# Altium project Lights_Board.PrjPcb (part 1 of 2)
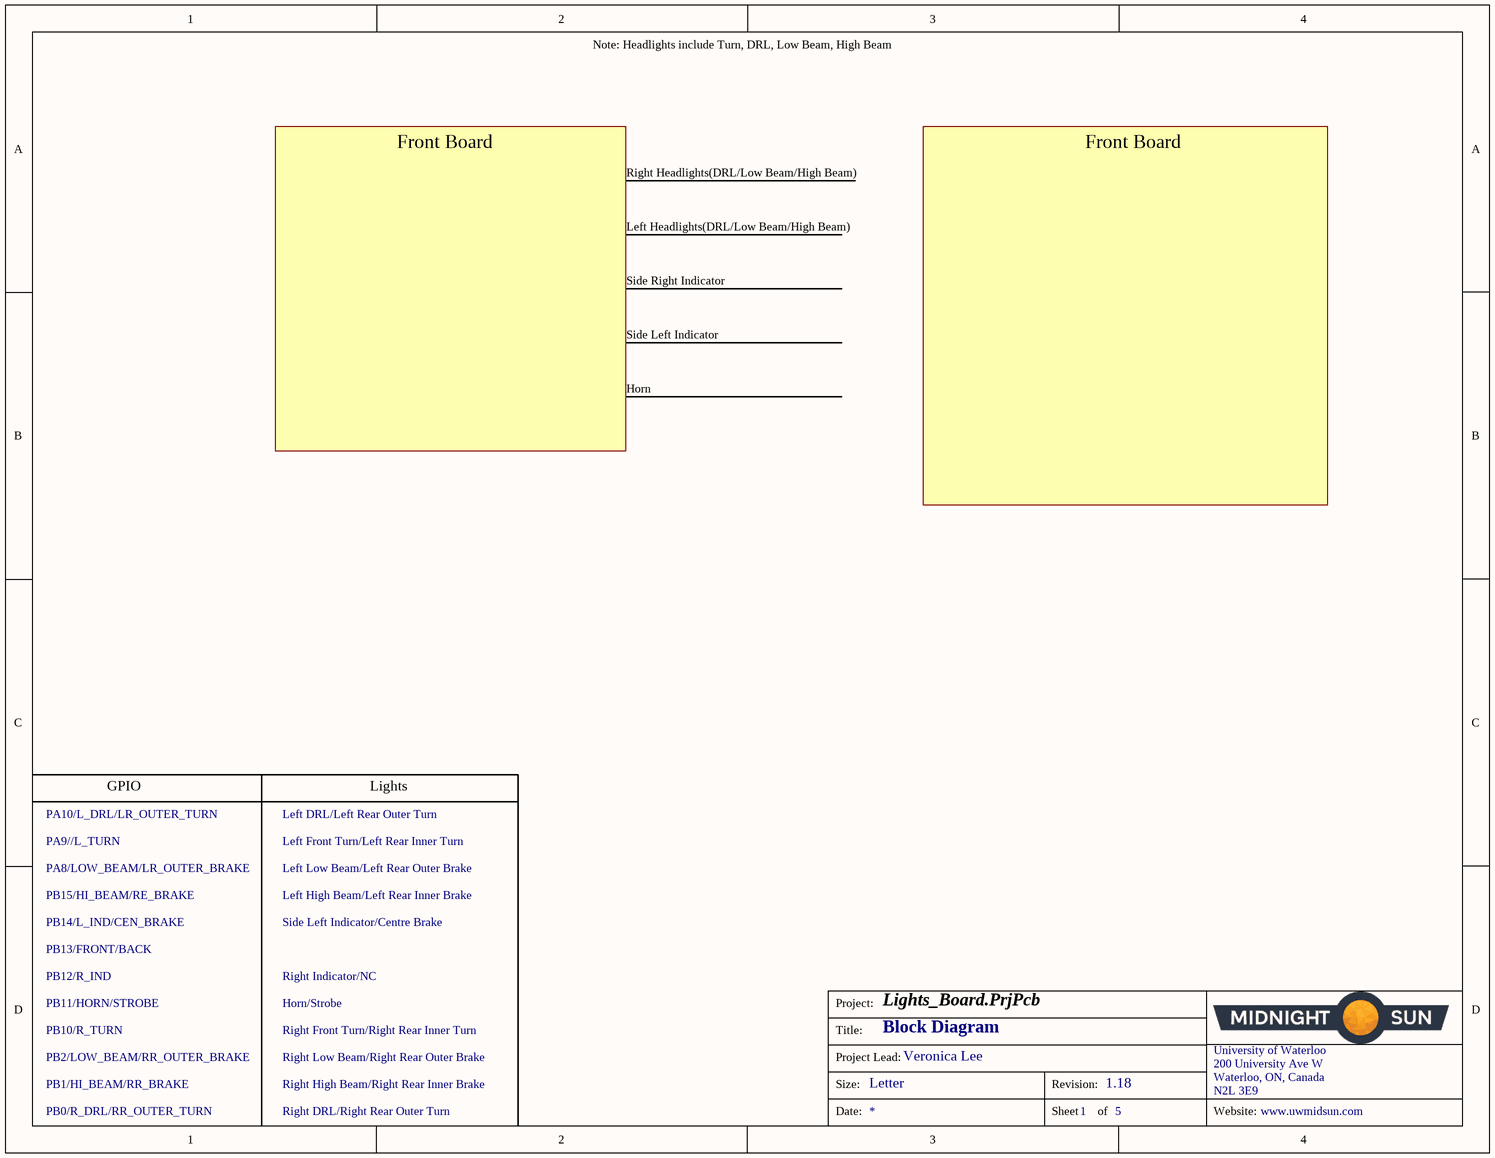
[diagram p0: Block_Diagram.SchDoc]
ProjectAuthor: Veronica Lee; ProjectRevision: 1.18
5 sheets, 80 parts. Net scope: flat (ports and power ports of the same name join across sheets).
Board file: MSXII_Lights.PcbDoc
Sheets:
  Block_Diagram.SchDoc
  Controller_Board_Interface.SchDoc
  Lights_Board.SchDoc
  Headlight_Left_Board.SchDoc
  Headlight_Right_Board.SchDoc

## Sheet Block_Diagram.SchDoc: Block Diagram
size Letter; Organization: Midnight Sun Solar Rayce Car Team; Address1: University of Waterloo; Address2: 200 University Ave W; Address3: Waterloo, ON, Canada; Address4: N2L 3E9; DocumentNumber: 1; SheetNumber: 1; SheetTotal: 5; Website: www.uwmidsun.com

### Notes on the sheet
- Note: Headlights include Turn, DRL, Low Beam, High Beam
- Front Board
- Right Headlights(DRL/Low Beam/High Beam)
- Left Headlights(DRL/Low Beam/High Beam)
- Side Right Indicator
- Side Left Indicator
- Horn
- PA10/L_DRL/LR_OUTER_TURN
- GPIO
- Left DRL/Left Rear Outer Turn
- Lights
- PA9//L_TURN
- PA8/LOW_BEAM/LR_OUTER_BRAKE
- PB15/HI_BEAM/RE_BRAKE
- Left Front Turn/Left Rear Inner Turn
- Left Low Beam/Left Rear Outer Brake
- Left High Beam/Left Rear Inner Brake
- PB14/L_IND/CEN_BRAKE
- PB13/FRONT/BACK
- Side Left Indicator/Centre Brake
- PB12/R_IND
- PB11/HORN/STROBE
- PB10/R_TURN
- Right Indicator/NC
- Horn/Strobe
- Right Front Turn/Right Rear Inner Turn
- PB2/LOW_BEAM/RR_OUTER_BRAKE
- PB1/HI_BEAM/RR_BRAKE
- Right Low Beam/Right Rear Outer Brake
- Right High Beam/Right Rear Inner Brake
- PB0/R_DRL/RR_OUTER_TURN
- Right DRL/Right Rear Outer Turn
- Project:
- Title:
- Size:
- Project Lead:
- Letter
- Revision:
- University of Waterloo
- 200 University Ave W
- Waterloo, ON, Canada
- N2L 3E9
- Date:
- Sheet
- of
- Website:

## Sheet Controller_Board_Interface.SchDoc
size Letter; DocumentNumber: 2; SheetNumber: 2; SheetTotal: 5; Website: www.uwmidsun.com
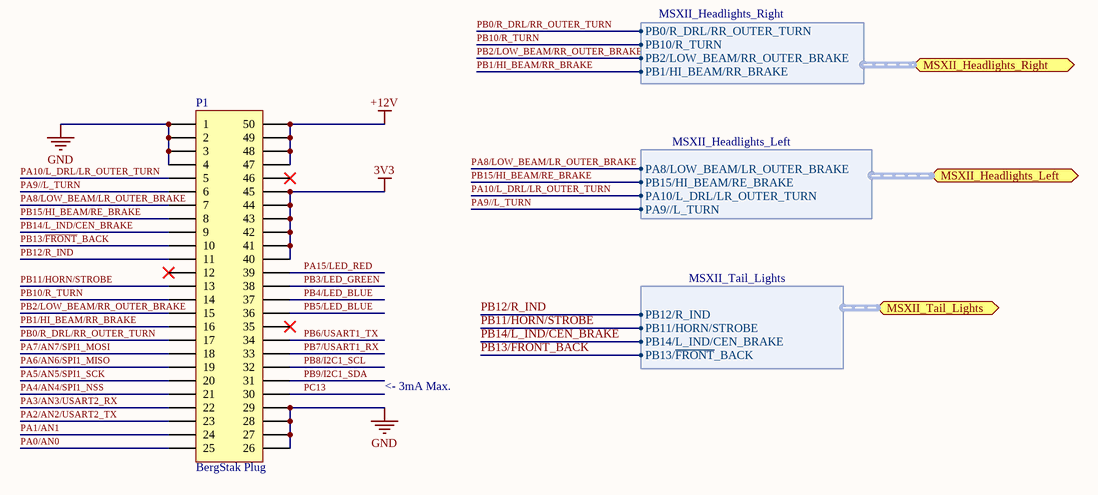
[diagram p1: Controller_Board_Interface.SchDoc]

### Parts
P1  Series: BergStak Plug  [CONN, Bergstak 50 Pos Plug]  (hidden comment: CONN 50POS Bergstak Plug 0.02")

### Ports
MSXII_Headlights_Left (harness MSXII_Headlights_Left), MSXII_Headlights_Right (harness MSXII_Headlights_Right), MSXII_Tail_Lights (harness MSXII_Tail_Lights)

### Harnesses
MSXII_Headlights_Right: PB0/R_DRL/RR_OUTER_TURN, PB10/R_TURN, PB2/LOW_BEAM/RR_OUTER_BRAKE, PB1/HI_BEAM/RR_BRAKE
MSXII_Headlights_Left: PA8/LOW_BEAM/LR_OUTER_BRAKE, PB15/HI_BEAM/RE_BRAKE, PA10/L_DRL/LR_OUTER_TURN, PA9//L_TURN
MSXII_Tail_Lights: PB14/L_IND/CEN_BRAKE, PB11/HORN/STROBE, PB12/R_IND, PB13/~{FRONT}_BACK

### Nets
3V3: P1.40 P1.41 P1.42 P1.43 P1.44 P1.45
+12V: P1.47 P1.48 P1.49 P1.50
GND: P1.1 P1.2 P1.3 P1.4 P1.26 P1.27 P1.28 P1.29
PA0/AN0: P1.25  [project net PA0/AN0_2]
PA1/AN1: P1.24  [project net PA1/AN1_2]
PA2/AN2/USART2_TX: P1.23  [project net PA2/AN2/USART2_TX_2]
PA3/AN3/USART2_RX: P1.22  [project net PA3/AN3/USART2_RX_2]
PA4/AN4/SPI1_NSS: P1.21  [project net PA4/AN4/SPI1_NSS_2]
PA5/AN5/SPI1_SCK: P1.20  [project net PA5/AN5/SPI1_SCK_2]
PA6/AN6/SPI1_MISO: P1.19  [project net PA6/AN6/SPI1_MISO_2]
PA7/AN7/SPI1_MOSI: P1.18  [project net PA7/AN7/SPI1_MOSI_2]
PA8/LOW_BEAM/LR_OUTER_BRAKE: P1.7 ; port MSXII_Headlights_Left.PA8/LOW_BEAM/LR_OUTER_BRAKE
PA9//L_TURN: P1.6 ; port MSXII_Headlights_Left.PA9//L_TURN
PA10/L_DRL/LR_OUTER_TURN: P1.5 ; port MSXII_Headlights_Left.PA10/L_DRL/LR_OUTER_TURN
PA15/LED_RED: P1.39  [project net PA15/LED_RED_2]
PB0/R_DRL/RR_OUTER_TURN: P1.17 ; port MSXII_Headlights_Right.PB0/R_DRL/RR_OUTER_TURN
PB1/HI_BEAM/RR_BRAKE: P1.16 ; port MSXII_Headlights_Right.PB1/HI_BEAM/RR_BRAKE
PB2/LOW_BEAM/RR_OUTER_BRAKE: P1.15 ; port MSXII_Headlights_Right.PB2/LOW_BEAM/RR_OUTER_BRAKE
PB3/LED_GREEN: P1.38  [project net PB3/LED_GREEN_2]
PB4/LED_BLUE: P1.37  [project net PB4/LED_BLUE_2]
PB5/LED_BLUE: P1.36  [project net PB5/LED_BLUE_2]
PB6/USART1_TX: P1.34  [project net PB6/USART1_TX_2]
PB7/USART1_RX: P1.33  [project net PB7/USART1_RX_2]
PB8/I2C1_SCL: P1.32  [project net PB8/I2C1_SCL_2]
PB9/I2C1_SDA: P1.31  [project net PB9/I2C1_SDA_2]
PB10/R_TURN: P1.14 ; port MSXII_Headlights_Right.PB10/R_TURN
PB11/HORN/STROBE: P1.13 ; port MSXII_Tail_Lights.PB11/HORN/STROBE
PB12/R_IND: P1.11 ; port MSXII_Tail_Lights.PB12/R_IND
PB13/~{FRONT}_BACK: P1.10 ; port MSXII_Tail_Lights.PB13/~{FRONT}_BACK
PB14/L_IND/CEN_BRAKE: P1.9 ; port MSXII_Tail_Lights.PB14/L_IND/CEN_BRAKE
PB15/HI_BEAM/RE_BRAKE: P1.8 ; port MSXII_Headlights_Left.PB15/HI_BEAM/RE_BRAKE
PC13: P1.30  [project net PC13_2]

Not connected (* = marked no-connect by the designer): P1 12* 35* 46*

### Notes on the sheet
- <- 3mA Max.
- Project:
- Title:
- Size:
- Project Lead:
- Letter
- Revision:
- University of Waterloo
- 200 University Ave W
- Waterloo, ON, Canada
- N2L 3E9
- Date:
- Sheet
- of
- Website:

### Library data of the parts
P1 = CONN 50POS Bergstak Plug 0.02": 50 Position Connector Plug, Outer Shroud Contacts Surface Mount Gold; Manufacturer 1: Amphenol FCI; Manufacturer Part Number 1: 10132797-055100LF; Number of Positions: 50; Mated Stacking Heights: 5mm; Pitch: 0.020" (0.50mm); Supplier 1: Digi-Key; Supplier Part Number 1: 609-5226-1-ND; Packaging: Cut Tape (CT); Part Status: Active; Connector Type: Plug, Outer Shroud Contacts; Number of Rows: 2; Mounting Type: Surface Mount; Contact Finish: Gold; Contact Finish Thickness: 1µin (0.025µm); Height Above Board: 0.169" (4.30mm); ComponentLink1URL: http://portal.fciconnect.com/Comergent//fci/drawing/10132797.pdf; ComponentLink1Description: http://portal.fciconnect.com/Comergent//fci/drawing/10132797.pdf

## Sheet Lights_Board.SchDoc: All Other Lights
size Letter; DocumentNumber: 3; Revision: 1.1; SheetNumber: 3; SheetTotal: 5; Website: www.uwmidsun.com
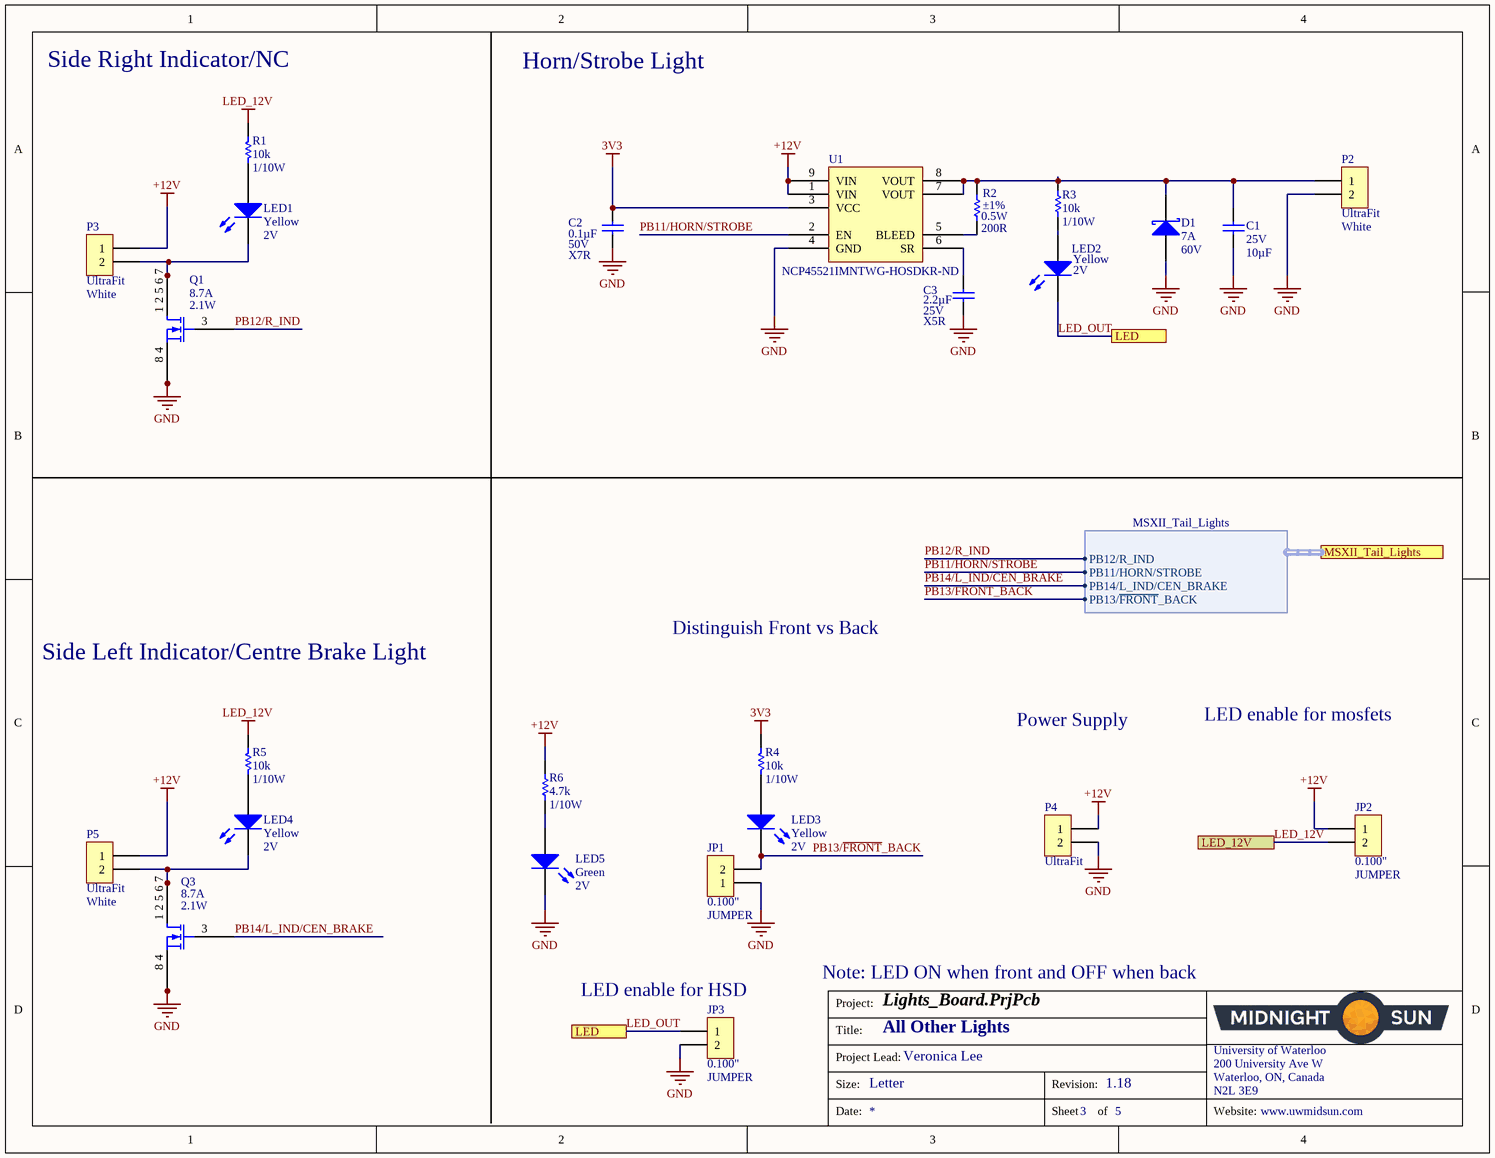
[diagram p2: Lights_Board.SchDoc]

### Parts
C1  Voltage - Rated: 25V  Capacitance: 10µF  [CAP, 0805]  (hidden comment: CAP CER 10uF 25V 10% X5R 0805)
C2  Capacitance: 0.1µF  Voltage: 50V  Temperature Coefficient: X7R  [CAP, 0603]  (hidden comment: CAP CER 0.1UF 50V 10% X7R 0603)
C3  Capacitance: 2.2µF  Voltage: 25V  Temperature Coefficient: X5R  [CAP, 0603]  (hidden comment: CAP CER 2.2UF 25V 10% X5R 0603)  (no BOM)
D1  Current - Average Rectified (Io): 7A  Voltage: 60V  [DIODE SCHOTTKY 60V 7A POWERDI5]  (hidden comment: DIODE SCHOTTKY 60V 7A POWERDI5)
JP1  Row Spacing - Mating: 0.100"  [CONN 2POS JUMPER 0.1"]  (hidden comment: JUMPER)
JP2  Row Spacing - Mating: 0.100"  [CONN 2POS JUMPER 0.1"]  (hidden comment: JUMPER)
JP3  Row Spacing - Mating: 0.100"  [CONN 2POS JUMPER 0.1"]  (hidden comment: JUMPER)
LED1  Color: Yellow  Voltage - Forward (Vf) (Typ): 2V  [LED_0603]  (hidden comment: LED YELLOW CLEAR 2.1V 0603)
LED2  Color: Yellow  Voltage - Forward (Vf) (Typ): 2V  [LED_0603]  (hidden comment: LED YELLOW CLEAR 2.1V 0603)
LED3  Color: Yellow  Voltage - Forward (Vf) (Typ): 2V  [LED_0603]  (hidden comment: LED YELLOW CLEAR 2.1V 0603)
LED4  Color: Yellow  Voltage - Forward (Vf) (Typ): 2V  [LED_0603]  (hidden comment: LED YELLOW CLEAR 2.1V 0603)
LED5  Color: Green  Voltage - Forward (Vf) (Typ): 2V  [LED_0603]  (hidden comment: LED GREEN CLEAR 2V 0603)
P2  Series: UltraFit  Color: White  [CONN, 2POS ULTRA-FIT - NATURAL COLOR]  (hidden comment: CONN 2POS ULTRA-FIT NATURAL COLOR 0.138")
P3  Series: UltraFit  Color: White  [CONN, 2POS ULTRA-FIT - NATURAL COLOR]  (hidden comment: CONN 2POS ULTRA-FIT NATURAL COLOR 0.138")
P4  Series: UltraFit  [CONN, 2POS ULTRA-FIT]  (hidden comment: CONN 2POS ULTRA-FIT 0.138")
P5  Series: UltraFit  Color: White  [CONN, 2POS ULTRA-FIT - NATURAL COLOR]  (hidden comment: CONN 2POS ULTRA-FIT NATURAL COLOR 0.138")
Q1  Current - Continuous Drain (Id) @ 25°C: 8.7A  Power Dissipation (Max): 2.1W  [MOSFET N-CH 30V 12A 2mmx2mm PQFN]  (hidden comment: MOSFET N-CH 30V 8.7A 2.1W 6-PQFN (2x2))
Q3  Current - Continuous Drain (Id) @ 25°C: 8.7A  Power Dissipation (Max): 2.1W  [MOSFET N-CH 30V 12A 2mmx2mm PQFN]  (hidden comment: MOSFET N-CH 30V 8.7A 2.1W 6-PQFN (2x2))
R1  Resistance: 10k  Power: 1/10W  [RES, 0603]  (hidden comment: RES 10K OHM 1% 1/10W 0603)
R2  resistance: 200R  Tolerance: ±1%  Power (Watts): 0.5W  [RES 0805]  (hidden comment: RES 200 OHM 5% 1/2W 0805)
R3  Resistance: 10k  Power: 1/10W  [RES, 0603]  (hidden comment: RES 10K OHM 1% 1/10W 0603)
R4  Resistance: 10k  Power: 1/10W  [RES, 0603]  (hidden comment: RES 10K OHM 1% 1/10W 0603)
R5  Resistance: 10k  Power: 1/10W  [RES, 0603]  (hidden comment: RES 10K OHM 1% 1/10W 0603)
R6  Resistance (Ohms): 4.7k  Power (Watts): 1/10W  [RES, 0603]  (hidden comment: RES 4.7K OHM 1% 1/10W 0603)
U1  Supplier Part Number 2: NCP45521IMNTWG-HOSDKR-ND  [IC LOAD SWITCH ACT-HI 10.5A 8DFN]  (hidden comment: IC LOAD SWITCH ACT-HI 10.5A 8DFN)

### Ports
LED, LED_12V (harness MSXII_Tail_Lights), MSXII_Tail_Lights (harness MSXII_Tail_Lights)

### Harnesses
MSXII_Tail_Lights: PB14/L_IND/CEN_BRAKE, PB11/HORN/STROBE, PB12/R_IND, PB13/~{FRONT}_BACK

### Nets
3V3: C2.1 R4.1 U1.3(VCC)
+12V: JP2.1 P3.1 P4.1 P5.1 R6.1 U1.1(VIN) U1.9(VIN)
GND: C1.2 C2.2 C3.2 D1.1 JP1.1 JP3.2 LED5.2(K) P2.2 P4.2 Q1.4(S) Q1.8(S) Q3.4(S) Q3.8(S) U1.4(GND)
LED_12V: JP2.2 R1.1 R5.1
LED_OUT: JP3.1 LED2.2(K) ; port LED
PB11/HORN/STROBE: U1.2(EN) ; port MSXII_Tail_Lights.PB11/HORN/STROBE
PB12/R_IND: Q1.3(G) ; port MSXII_Tail_Lights.PB12/R_IND
PB13/~{FRONT}_BACK: JP1.2 LED3.2(K) ; port MSXII_Tail_Lights.PB13/~{FRONT}_BACK
PB14/L_IND/CEN_BRAKE: Q3.3(G) ; port MSXII_Tail_Lights.PB14/L_IND/CEN_BRAKE
NetC1_1: C1.1 D1.2 P2.1 R2.1 R3.1 U1.7(VOUT) U1.8(VOUT)
NetC3_1: C3.1 U1.6(SR)
NetLED1_1: LED1.1(A) R1.2
NetLED1_2: LED1.2(K) P3.2 Q1.1(D) Q1.2(D) Q1.5(D) Q1.6(D) Q1.7(D)
NetLED2_1: LED2.1(A) R3.2
NetLED3_1: LED3.1(A) R4.2
NetLED4_1: LED4.1(A) R5.2
NetLED4_2: LED4.2(K) P5.2 Q3.1(D) Q3.2(D) Q3.5(D) Q3.6(D) Q3.7(D)
NetLED5_1: LED5.1(A) R6.2
NetR2_2: R2.2 U1.5(BLEED)

### Notes on the sheet
- Side Right Indicator/NC
- Horn/Strobe Light
- Distinguish Front vs Back
- Side Left Indicator/Centre Brake Light
- Power Supply
- LED enable for mosfets
- (near JP3) LED enable for HSD
- Note: LED ON when front and OFF when back
- Project:
- Title:
- Size:
- Project Lead:
- Letter
- Revision:
- University of Waterloo
- 200 University Ave W
- Waterloo, ON, Canada
- N2L 3E9
- Date:
- Sheet
- of
- Website:

### Library data of the parts
C1 = CAP CER 10uF 25V 10% X5R 0805: 10µF ±10% 25V Ceramic Capacitor X5R 0805 (2012 Metric); Manufacturer: Murata Electronics North America; Manufacturer Part Number: GRM21BR61E106KA73L; Supplier 1: Digi-Key; RoHS: RoHS Compliant; Category: Capacitors; Stock 1: 1695157; Packaging: Cut Tape (CT); Part Status: Active; Tolerance: ±10%; Temperature Coefficient: X5R; Operating Temperature: -55°C ~ 85°C; Features: -; Ratings: -; Applications: General Purpose; Mounting Type: Surface Mount, MLCC; Package / Case: 0805 (2012 Metric); Size / Dimension: 0.079" L x 0.049" W (2.00mm x 1.25mm); Height - Seated (Max): -; Thickness (Max): 0.053" (1.35mm); Lead Spacing: -; Lead Style: -; ComponentLink1URL: http://search.murata.co.jp/Ceramy/image/img/A01X/G101/ENG/GRM21BR61E106KA73-01.pdf; ComponentLink1Description: http://search.murata.co.jp/Ceramy/image/img/A01X/G101/ENG/GRM21BR61E106KA73-01.pdf; Supplier Part Number 1: 490-5523-1-ND; Pricing 1: 1=0.3, 10=0.214, 100=0.1008, 500=0.07068, 1000=0.05851 (CAD)
C2 = CAP CER 0.1UF 50V 10% X7R 0603: 0.10µF ±10% 50V Ceramic Capacitor X7R 0603 (1608 Metric); Manufacturer 1: AVX Corporation; Manufacturer Part Number 1: 06035C104KAT2A; Supplier 1: Digi-Key; Supplier Part Number 1: 478-5052-1-ND; Packaging: Cut Tape (CT); Part Status: Active; Operating Temperature: -55°C ~ 125°C; Ratings: -; Mounting Type: Surface Mount, MLCC; Package / Case: 0603 (1608 Metric); Size / Dimension: 0.063" L x 0.032" W (1.60mm x 0.81mm); Height - Seated (Max): -; Thickness (Max): 0.035" (0.90mm); Lead Spacing: -; Lead Style: -; ComponentLink1URL: http://datasheets.avx.com/X7RDielectric.pdf; ComponentLink1Description: http://datasheets.avx.com/X7RDielectric.pdf; Tolerance: ±10%
C3 = CAP CER 2.2UF 25V 10% X5R 0603: 2.2µF ±10% 25V Ceramic Capacitor X5R 0603 (1608 Metric); Manufacturer 1: Murata Electronics North America; Manufacturer Part Number 1: GRM188R61E225KA12D; Supplier 1: Digi-Key; Supplier Part Number 1: 490-10731-1-ND; Packaging: Cut Tape (CT); Part Status: Active; Operating Temperature: -55°C ~ 85°C; Ratings: -; Mounting Type: Surface Mount, MLCC; Package / Case: 0603 (1608 Metric); Size / Dimension: 0.063" L x 0.031" W (1.60mm x 0.80mm); Height - Seated (Max): -; Thickness (Max): 0.035" (0.90mm); Lead Spacing: -; Lead Style: -; ComponentLink1URL: http://www.murata.com/~/media/webrenewal/support/library/catalog/products/capacitor/mlcc/c02e.ashx; ComponentLink1Description: http://www.murata.com/~/media/webrenewal/support/library/catalog/products/capacitor/mlcc/c02e.ashx; Tolerance: ±10%
D1 = DIODE SCHOTTKY 60V 7A POWERDI5: Diode Schottky 60V 7A Surface Mount PowerDI™ 5; Manufacturer: Diodes Incorporated; Manufacturer Part Number: PDS760Q-13; Speed: Fast Recovery =< 500ns, > 200mA (Io); Supplier 1: Digi-Key; RoHS: RoHS Compliant; Category: Discrete Semiconductor Products; Stock 1: 35000; Pricing 1: 5000=0.48794, 10000=0.4696 (CAD); Packaging: Tape & Reel (TR); Part Status: Active; Diode Type: Schottky; Capacitance @ Vr, F: -; Mounting Type: Surface Mount; Package / Case: PowerDI™ 5; Supplier Device Package: PowerDI™ 5; Operating Temperature - Junction: -65°C ~ 150°C; ComponentLink1URL: https://www.diodes.com/assets/Datasheets/PDS760Q.pdf; ComponentLink1Description: https://www.diodes.com/assets/Datasheets/PDS760Q.pdf; Supplier 2: Digi-Key; Stock 2: 36638; Pricing 2: 1=1.24, 10=1.115, 100=0.8692, 500=0.71798, 1000=0.56682 (CAD)
JP1-JP3 = CONN 2POS JUMPER 0.1": 2 Positions Header Connector Through Hole Gold; Manufacturer: Omron Electronics Inc-EMC Div; Manufacturer Part Number: XG8T-0231; Style: Board to Board or Cable; Shrouding: Unshrouded; Number of Positions: 2; Number of Positions Loaded: All; Contact Length - Mating: 0.169" (4.30mm); Contact Length - Post: 0.118" (3.00mm); Overall Contact Length: 0.386" (9.80mm); Material Flammability Rating: UL94 V-0; Current Rating: 2A; Voltage Rating: 300V; Supplier 1: Digi-Key; RoHS: RoHS Compliant; Category: Connectors, Interconnects; Stock 1: 9094; Pricing 1: 1=0.28, 10=0.265, 100=0.183, 500=0.15484, 1000=0.12668, 5000=0.11261, 10000=0.10205 (CAD); Packaging: Bulk; Part Status: Active; Connector Type: Header; Contact Type: Male Pin; Pitch - Mating: -; Number of Rows: 2; Mounting Type: Through Hole; Termination: Solder; Fastening Type: -; Insulation Height: 0.098" (2.50mm); Contact Shape: Square; Contact Finish - Mating: Gold; Contact Finish Thickness - Mating: 5.9µin (0.15µm); Contact Finish - Post: Tin; Contact Material: Brass, Nickel; Insulation Material: Polybutylene Terephthalate (PBT), Glass Filled; Features: -; Operating Temperature: -55°C ~ 105°C; Ingress Protection: -; Insulation Color: Black; Mated Stacking Heights: -; Contact Finish Thickness - Post: -; Applications: -; ComponentLink1URL: http://www.omron.com/ecb/products/pdf/en-xj8.pdf; ComponentLink1Description: http://www.omron.com/ecb/products/pdf/en-xj8.pdf; Supplier Part Number 1: XG8T-0231-ND; Type: JUMPER
LED1-LED4 = LED YELLOW CLEAR 2.1V 0603: Yellow 590nm LED Indication - Discrete 2V 0603 (1608 Metric); Manufacturer: Wurth Electronics Inc.; Manufacturer Part Number: 150060YS75000; Lens Color: Colorless; Millicandela Rating: 120mcd; Lens Style/Size: Rectangle with Flat Top, 1.10mm x 0.70mm; Current - Test: 20mA; Viewing Angle: 140°; Wavelength - Peak: 595nm; Supplier 1: Digi-Key; RoHS: RoHS Compliant; Category: Optoelectronics; Stock 1: 10523; Pricing 1: 1=0.21, 100=0.1617, 500=0.13964 (CAD); Packaging: Cut Tape (CT); Part Status: Active; Lens Transparency: Clear; Mounting Type: Surface Mount; Wavelength - Dominant: 590nm; Features: -; Package / Case: 0603 (1608 Metric); Supplier Device Package: 0603; Size / Dimension: 1.60mm L x 0.80mm W; Height (Max): 0.80mm; ComponentLink1URL: http://katalog.we-online.de/led/datasheet/150060YS75000.pdf; ComponentLink1Description: http://katalog.we-online.de/led/datasheet/150060YS75000.pdf; Supplier Part Number 1: 732-4981-1-ND
LED5 = LED GREEN CLEAR 2V 0603: Green 572nm LED Indication - Discrete 2V 0603 (1608 Metric); Manufacturer: Wurth Electronics Inc.; Manufacturer Part Number: 150060VS75000; Lens Color: Colorless; Millicandela Rating: 40mcd; Lens Style/Size: Rectangle with Flat Top, 1.10mm x 0.70mm; Current - Test: 20mA; Viewing Angle: 140°; Wavelength - Dominant: 570nm; Supplier 1: Digi-Key; RoHS: RoHS Compliant; Category: Optoelectronics; Stock 1: 9408; Pricing 1: 1=0.21, 100=0.1617, 500=0.13964 (CAD); Packaging: Cut Tape (CT); Part Status: Active; Lens Transparency: Clear; Mounting Type: Surface Mount; Wavelength - Peak: 572nm; Features: -; Package / Case: 0603 (1608 Metric); Supplier Device Package: 0603; Size / Dimension: 1.60mm L x 0.80mm W; Height (Max): 0.80mm; ComponentLink1URL: http://katalog.we-online.de/led/datasheet/150060VS75000.pdf; ComponentLink1Description: http://katalog.we-online.de/led/datasheet/150060VS75000.pdf; Supplier Part Number 1: 732-4980-1-ND
P2 P3 P5 = CONN 2POS ULTRA-FIT NATURAL COLOR 0.138": 2 Positions Header, Shrouded Connector 0.138" (3.50mm) Through Hole; Manufacturer 1: Molex, LLC; Manufacturer Part Number 1: 1722872102; Style: Board to Cable/Wire; Shrouding: Shrouded - 4 Wall; Number of Positions: 2; Number of Positions Loaded: All; Contact Length - Post: 0.126" (3.20mm); Material Flammability Rating: UL94 V-0; Mated Stacking Heights: 26.99mm; Voltage: 400V; Supplier 1: Digi-Key; Supplier Part Number 1: WM11722-ND; Packaging: Tray; Part Status: Active; Connector Type: Header; Contact Type: Male Pin; Pitch - Mating: 0.138" (3.50mm); Number of Rows: 1; Row Spacing - Mating: -; Mounting Type: Through Hole; Termination: Solder; Fastening Type: Latch Holder; Contact Length - Mating: -; Overall Contact Length: -; Insulation Height: 0.465" (11.80mm); Contact Shape: Square; Contact Finish - Mating: Tin; Contact Finish Thickness - Mating: 60µin (1.52µm); Contact Finish - Post: Tin; Contact Material: Copper Alloy; Insulation Material: Liquid Crystal Polymer (LCP); Operating Temperature: -40°C ~ 105°C; Ingress Protection: -; Insulation Color: Natural; Current Rating: -; Contact Finish Thickness - Post: 60µin (1.52µm); ComponentLink1URL: http://www.molex.com/pdm_docs/sd/1722872102_sd.pdf; ComponentLink1Description: http://www.molex.com/pdm_docs/sd/1722872102_sd.pdf
P4 = CONN 2POS ULTRA-FIT 0.138": 2 Positions Header, Shrouded Connector 0.138" (3.50mm) Through Hole Gold; Manufacturer 1: Molex, LLC; Manufacturer Part Number 1: 1722861302; Style: Board to Board or Cable; Shrouding: Shrouded - 4 Wall; Number of Positions: 2; Number of Positions Loaded: All; Contact Length - Post: 0.126" (3.20mm); Material Flammability Rating: UL94 V-0; Mated Stacking Heights: 26.99mm; Voltage: 400V; Supplier 1: Digi-Key; Supplier Part Number 1: WM11673-ND; Packaging: Tray; Part Status: Active; Connector Type: Header; Contact Type: Male Pin; Pitch - Mating: 0.138" (3.50mm); Number of Rows: 1; Row Spacing - Mating: -; Mounting Type: Through Hole; Termination: Kinked Pin, Solder; Fastening Type: Latch Holder; Contact Length - Mating: -; Overall Contact Length: -; Insulation Height: 0.465" (11.80mm); Contact Shape: Square; Contact Finish - Mating: Gold; Contact Finish Thickness - Mating: 30µin (0.76µm); Contact Finish - Post: Tin; Contact Material: Copper Alloy; Insulation Material: Liquid Crystal Polymer (LCP); Operating Temperature: -40°C ~ 120°C; Ingress Protection: -; Insulation Color: Black; Current Rating: -; Contact Finish Thickness - Post: 60µin (1.52µm); ComponentLink1URL: http://www.molex.com/pdm_docs/sd/1722861302_sd.pdf; ComponentLink1Description: http://www.molex.com/pdm_docs/sd/1722861302_sd.pdf
Q1 Q3 = MOSFET N-CH 30V 8.7A 2.1W 6-PQFN (2x2): N-Channel 30V 8.7A (Ta), 19A (Tc) 2.1W (Ta) Surface Mount 6-PQFN (2x2); Manufacturer 1: Infineon Technologies; Manufacturer Part Number 1: IRLHS6342TRPBF; Description 1: MOSFET N-CH 30V 8.7A 2X2 PQFN; Drive Voltage (Max Rds On,  Min Rds On): 2.5V, 4.5V; Vgs(th) (Max) @ Id: 1.1V @ 10µA; Gate Charge (Qg) (Max) @ Vgs: 11nC @ 4.5V; Input Capacitance (Ciss) (Max) @ Vds: 1019pF @ 25V; Vgs (Max): ±12V; Rds On (Max) @ Id, Vgs: 15.5 mOhm @ 8.5A, 4.5V; Supplier 1: Digi-Key; Supplier Part Number 1: IRLHS6342TRPBFCT-ND; RoHS: RoHS Compliant; Category: Discrete Semiconductor Products; Stock 1: 9984; Pricing 1: 1=0.79, 10=0.685, 100=0.5118, 500=0.4022, 1000=0.31079 (CAD); Packaging: Cut Tape (CT); Part Status: Active; FET Type: N-Channel; Technology: MOSFET (Metal Oxide); Drain to Source Voltage (Vdss): 30V; FET Feature: -; Operating Temperature: -55°C ~ 150°C (TJ); Mounting Type: Surface Mount; Supplier Device Package: 6-PQFN (2x2); Package / Case: 6-PowerVDFN; ComponentLink1URL: http://www.infineon.com/dgdl/irlhs6342pbf.pdf?fileId=5546d462533600a401535663b52625ad; ComponentLink1Description: http://www.infineon.com/dgdl/irlhs6342pbf.pdf?fileId=5546d462533600a401535663b52625ad
R1 R3-R5 = RES 10K OHM 1% 1/10W 0603: RES SMD 10K OHM 1% 1/10W 0603; Manufacturer 1: Yageo; Manufacturer Part Number 1: RC0603FR-0710KL; Temperature Coefficient: ±100ppm/°C; Supplier 1: Digi-Key; Supplier Part Number 1: 311-10.0KHRCT-ND; Packaging: Cut Tape (CT); Part Status: Active; Composition: Thick Film; Operating Temperature: -55°C ~ 155°C; Package / Case: 0603 (1608 Metric); Supplier Device Package: 0603; Size / Dimension: 0.063" L x 0.031" W (1.60mm x 0.80mm); Height - Seated (Max): 0.022" (0.55mm); Failure Rate: -; ComponentLink1URL: http://www.yageo.com/documents/recent/PYu-RC_Group_51_RoHS_L_7.pdf; ComponentLink1Description: http://www.yageo.com/documents/recent/PYu-RC_Group_51_RoHS_L_7.pdf; Tolerance: ±1%
R2 = RES 200 OHM 5% 1/2W 0805: 200 Ohms ±5% 0.5W, 1/2W Chip Resistor 0805 (2012 Metric) Automotive AEC-Q200, Pulse Withstanding Thick Film; Manufacturer: Panasonic Electronic Components; Manufacturer Part Number: ERJ-P06F2000V; Temperature Coefficient: ±100ppm/°C; Supplier 1: Digi-Key; RoHS: RoHS Compliant; Category: Resistors; Stock 1: 46234; Pricing 1: 1=0.27, 10=0.226, 100=0.0884, 1000=0.03699, 2500=0.0339 (CAD); Packaging: Cut Tape (CT); Part Status: Active; Composition: Thick Film; Features: Automotive AEC-Q200, Pulse Withstanding; Operating Temperature: -55°C ~ 155°C; Package / Case: 0805 (2012 Metric); Supplier Device Package: 0805; Size / Dimension: 0.079" L x 0.049" W (2.00mm x 1.25mm); Height - Seated (Max): 0.028" (0.70mm); Failure Rate: -; ComponentLink1URL: https://industrial.panasonic.com/cdbs/www-data/pdf/RDO0000/AOA0000C331.pdf; ComponentLink1Description: https://industrial.panasonic.com/cdbs/www-data/pdf/RDO0000/AOA0000C331.pdf
R6 = RES 4.7K OHM 1% 1/10W 0603: 4.7k Ohm ±1% 0.1W, 1/10W Chip Resistor 0603 (1608 Metric) Moisture Resistant Thick Film; Manufacturer 1: Yageo; Manufacturer Part Number 1: RC0603FR-074K7L; Description 1: RES SMD 4.7K OHM 1% 1/10W 0603; Temperature Coefficient: ±100ppm/°C; Supplier 1: Digi-Key; Supplier Part Number 1: 311-4.70KHRCT-ND; RoHS: RoHS Compliant; Category: Resistors; Stock 1: 3487566; Pricing 1: 1=0.16, 10=0.022, 100=0.0089, 1000=0.00402, 2500=0.00349 (CAD); Packaging: Cut Tape (CT); Part Status: Active; Composition: Thick Film; Features: Moisture Resistant; Operating Temperature: -55°C ~ 155°C; Package / Case: 0603 (1608 Metric); Supplier Device Package: 0603; Size / Dimension: 0.063" L x 0.031" W (1.60mm x 0.80mm); Height - Seated (Max): 0.022" (0.55mm); Failure Rate: -; ComponentLink1URL: http://www.yageo.com/documents/recent/PYu-RC_Group_51_RoHS_L_7.pdf; ComponentLink1Description: http://www.yageo.com/documents/recent/PYu-RC_Group_51_RoHS_L_7.pdf; Tolerance: ±1%
U1 = IC LOAD SWITCH ACT-HI 10.5A 8DFN: NCP45521IMNTWG-H; Manufacturer: ON Semiconductor; Switch Type: General Purpose; Number of Outputs: 1; Ratio - Input:Output: 1:1; Output Configuration: High Side; Output Type: N-Channel; Interface: On/Off; Voltage - Load: 0.5 V ~ 13.5 V; Voltage - Supply (Vcc/Vdd): 3 V ~ 5.5 V; Rds On (Typ): 12.8 mOhm; Input Type: Non-Inverting; Fault Protection: Over Temperature, UVLO; Manufacturer Part Number: NCP45521IMNTWG-H; RoHS: RoHS Compliant; Category: Integrated Circuits (ICs); Packaging: Digi-Reel®; Part Status: Active; Current - Output (Max): 10.5A; Features: Slew Rate Controlled; Operating Temperature: -40°C ~ 85°C (TA); Package / Case: 8-VFDFN Exposed Pad; Supplier Device Package: 8-DFN (2x2); ComponentLink1URL: http://www.onsemi.com/pub/Collateral/NCP45520-D.PDF; ComponentLink1Description: http://www.onsemi.com/pub/Collateral/NCP45520-D.PDF; Supplier 1: Digi-Key; Stock 1: 2377; Pricing 1: 1=1.57, 10=1.405, 100=1.0957, 500=0.90518, 1000=0.71462 (CAD); Supplier 2: Digi-Key; Stock 2: 2211; Pricing 2: 1=1.53, 10=1.372, 100=1.0702, 500=0.88408, 1000=0.69797 (CAD)

## Sheet Headlight_Left_Board.SchDoc: Left Headlights
size Letter; Organization: Midnight Sun Solar Rayce Car Team; Address1: University of Waterloo; Address2: 200 University Ave W; Address3: Waterloo, ON, Canada; Address4: N2L 3E9; DocumentNumber: 4; SheetNumber: 4; SheetTotal: 5; Website: www.uwmidsun.com
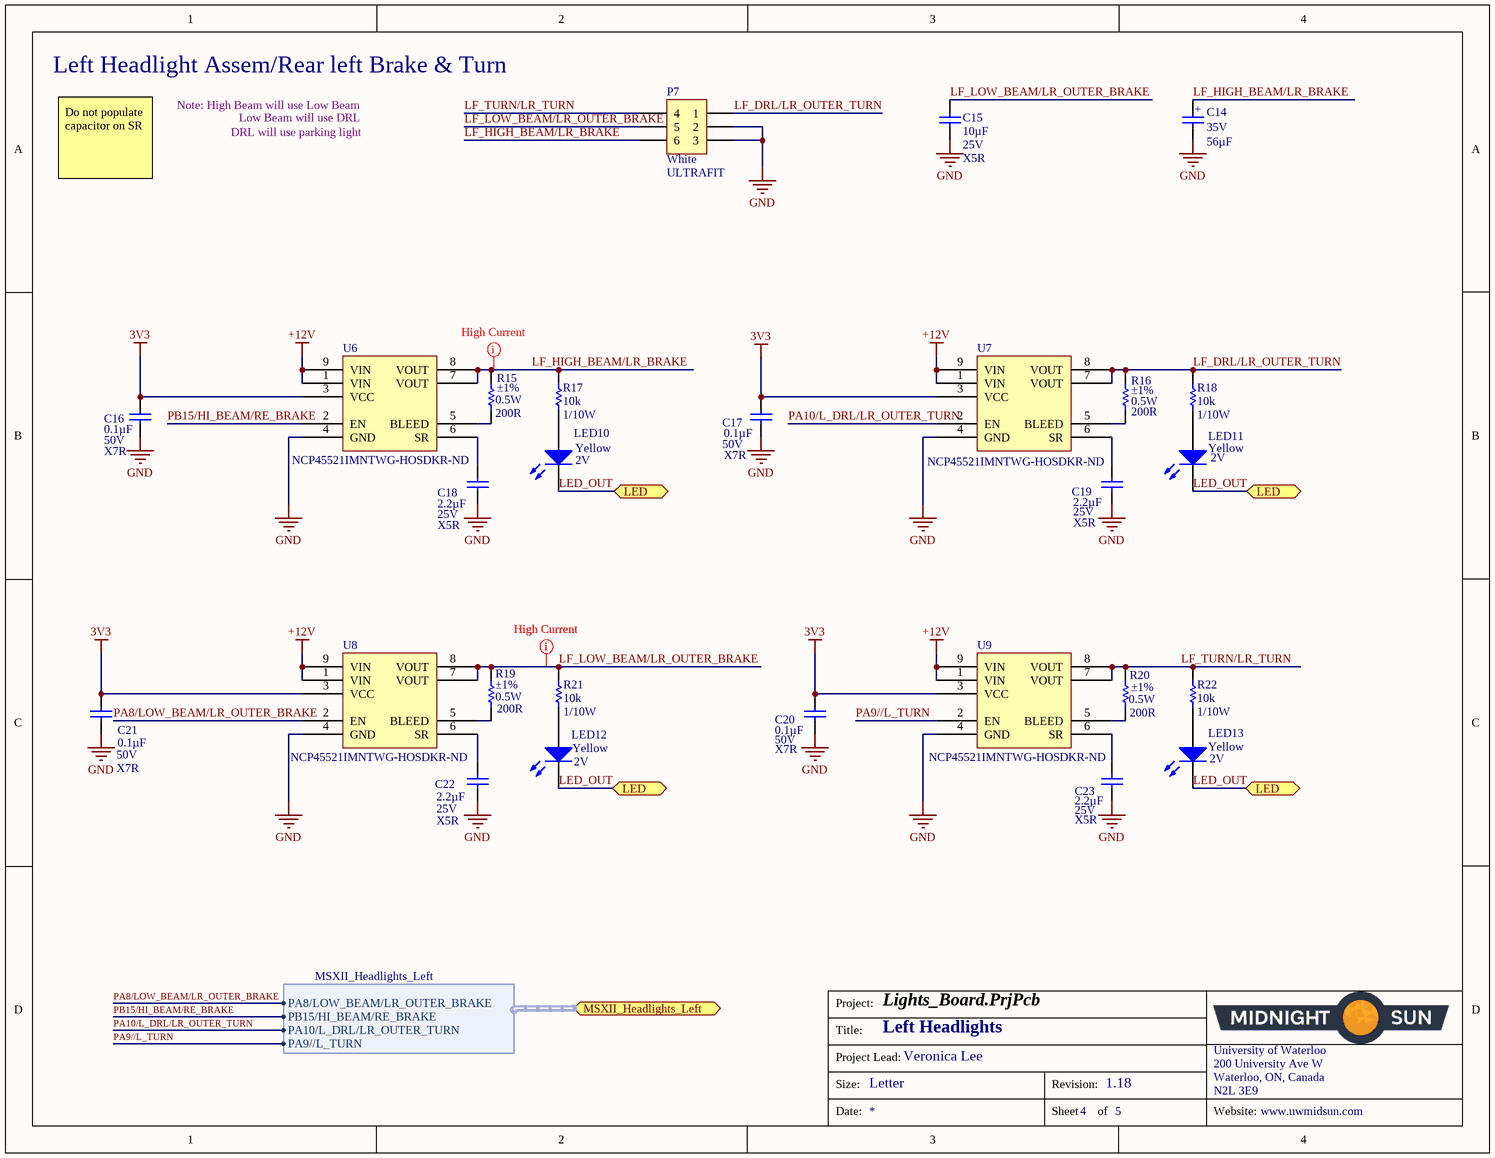
[diagram p3: Headlight_Left_Board.SchDoc]

### Parts
C14  Voltage: 35V  Capacitance: 56µF  [CAP ALUM 56UF 20% 35V RADIAL]  (hidden comment: CAP ALUM 56UF 20% 35V RADIAL)
C15  Capacitance: 10µF  Voltage: 25V  Temperature Coefficient: X5R  [CAP, 0603]  (hidden comment: CAP CER 10uF 25V 20% X5R 0603)
C16  Capacitance: 0.1µF  Voltage: 50V  Temperature Coefficient: X7R  [CAP, 0603]  (hidden comment: CAP CER 0.1UF 50V 10% X7R 0603)
C17  Capacitance: 0.1µF  Voltage: 50V  Temperature Coefficient: X7R  [CAP, 0603]  (hidden comment: CAP CER 0.1UF 50V 10% X7R 0603)
C18  Capacitance: 2.2µF  Voltage: 25V  Temperature Coefficient: X5R  [CAP, 0603]  (hidden comment: CAP CER 2.2UF 25V 10% X5R 0603)  (no BOM)
C19  Capacitance: 2.2µF  Voltage: 25V  Temperature Coefficient: X5R  [CAP, 0603]  (hidden comment: CAP CER 2.2UF 25V 10% X5R 0603)  (no BOM)
C20  Capacitance: 0.1µF  Voltage: 50V  Temperature Coefficient: X7R  [CAP, 0603]  (hidden comment: CAP CER 0.1UF 50V 10% X7R 0603)
C21  Capacitance: 0.1µF  Voltage: 50V  Temperature Coefficient: X7R  [CAP, 0603]  (hidden comment: CAP CER 0.1UF 50V 10% X7R 0603)
C22  Capacitance: 2.2µF  Voltage: 25V  Temperature Coefficient: X5R  [CAP, 0603]  (hidden comment: CAP CER 2.2UF 25V 10% X5R 0603)  (no BOM)
C23  Capacitance: 2.2µF  Voltage: 25V  Temperature Coefficient: X5R  [CAP, 0603]  (hidden comment: CAP CER 2.2UF 25V 10% X5R 0603)  (no BOM)
LED10  Color: Yellow  Voltage - Forward (Vf) (Typ): 2V  [LED_0603]  (hidden comment: LED YELLOW CLEAR 2.1V 0603)
LED11  Color: Yellow  Voltage - Forward (Vf) (Typ): 2V  [LED_0603]  (hidden comment: LED YELLOW CLEAR 2.1V 0603)
LED12  Color: Yellow  Voltage - Forward (Vf) (Typ): 2V  [LED_0603]  (hidden comment: LED YELLOW CLEAR 2.1V 0603)
LED13  Color: Yellow  Voltage - Forward (Vf) (Typ): 2V  [LED_0603]  (hidden comment: LED YELLOW CLEAR 2.1V 0603)
P7  Insulation Color: White  Series: ULTRAFIT  [CONN, 6POS ULTRA-FIT - NATURAL COLOR]  (hidden comment: CONN 6POS ULTRA-FIT NATURAL COLOR 0.138")
R15  value 200R  Tolerance: ±1%  Power (Watts): 0.5W  [RES 0805]  (hidden comment: RES SMD 200 OHM 1% 1/2W 0805)
R16  value 200R  Tolerance: ±1%  Power (Watts): 0.5W  [RES 0805]  (hidden comment: RES SMD 200 OHM 1% 1/2W 0805)
R17  Resistance: 10k  Power: 1/10W  [RES, 0603]  (hidden comment: RES 10K OHM 1% 1/10W 0603)
R18  Resistance: 10k  Power: 1/10W  [RES, 0603]  (hidden comment: RES 10K OHM 1% 1/10W 0603)
R19  value 200R  Tolerance: ±1%  Power (Watts): 0.5W  [RES 0805]  (hidden comment: RES SMD 200 OHM 1% 1/2W 0805)
R20  value 200R  Tolerance: ±1%  Power (Watts): 0.5W  [RES 0805]  (hidden comment: RES SMD 200 OHM 1% 1/2W 0805)
R21  Resistance: 10k  Power: 1/10W  [RES, 0603]  (hidden comment: RES 10K OHM 1% 1/10W 0603)
R22  Resistance: 10k  Power: 1/10W  [RES, 0603]  (hidden comment: RES 10K OHM 1% 1/10W 0603)
U6  Supplier Part Number 2: NCP45521IMNTWG-HOSDKR-ND  [IC LOAD SWITCH ACT-HI 10.5A 8DFN]  (hidden comment: IC LOAD SWITCH ACT-HI 10.5A 8DFN)
U7  Supplier Part Number 2: NCP45521IMNTWG-HOSDKR-ND  [IC LOAD SWITCH ACT-HI 10.5A 8DFN]  (hidden comment: IC LOAD SWITCH ACT-HI 10.5A 8DFN)
U8  Supplier Part Number 2: NCP45521IMNTWG-HOSDKR-ND  [IC LOAD SWITCH ACT-HI 10.5A 8DFN]  (hidden comment: IC LOAD SWITCH ACT-HI 10.5A 8DFN)
U9  Supplier Part Number 2: NCP45521IMNTWG-HOSDKR-ND  [IC LOAD SWITCH ACT-HI 10.5A 8DFN]  (hidden comment: IC LOAD SWITCH ACT-HI 10.5A 8DFN)

### Ports
LED, MSXII_Headlights_Left (harness MSXII_Headlights_Left)

### Harnesses
MSXII_Headlights_Left: PA8/LOW_BEAM/LR_OUTER_BRAKE, PB15/HI_BEAM/RE_BRAKE, PA10/L_DRL/LR_OUTER_TURN, PA9//L_TURN

### Nets
3V3: C16.1 C17.1 C20.1 C21.1 U6.3(VCC) U7.3(VCC) U8.3(VCC) U9.3(VCC)
+12V: U6.1(VIN) U6.9(VIN) U7.1(VIN) U7.9(VIN) U8.1(VIN) U8.9(VIN) U9.1(VIN) U9.9(VIN)
GND: C14.2 C15.1 C16.2 C17.2 C18.2 C19.2 C20.2 C21.2 C22.2 C23.2 P7.2 P7.3 U6.4(GND) U7.4(GND) U8.4(GND) U9.4(GND)
LED_OUT: LED10.2(K) LED11.2(K) LED12.2(K) LED13.2(K) ; port LED
LF_DRL/LR_OUTER_TURN: P7.1 R16.1 R18.1 U7.7(VOUT) U7.8(VOUT)  [project net LF_DRL/LR_OUTER_TURN_4]
LF_HIGH_BEAM/LR_BRAKE: C14.1 P7.6 R15.1 R17.1 U6.7(VOUT) U6.8(VOUT)  [project net LF_HIGH_BEAM/LR_BRAKE_4]
LF_LOW_BEAM/LR_OUTER_BRAKE: C15.2 P7.5 R19.1 R21.1 U8.7(VOUT) U8.8(VOUT)  [project net LF_LOW_BEAM/LR_OUTER_BRAKE_4]
LF_TURN/LR_TURN: P7.4 R20.1 R22.1 U9.7(VOUT) U9.8(VOUT)  [project net LF_TURN/LR_TURN_4]
PA8/LOW_BEAM/LR_OUTER_BRAKE: U8.2(EN) ; port MSXII_Headlights_Left.PA8/LOW_BEAM/LR_OUTER_BRAKE
PA9//L_TURN: U9.2(EN) ; port MSXII_Headlights_Left.PA9//L_TURN
PA10/L_DRL/LR_OUTER_TURN: U7.2(EN) ; port MSXII_Headlights_Left.PA10/L_DRL/LR_OUTER_TURN
PB15/HI_BEAM/RE_BRAKE: U6.2(EN) ; port MSXII_Headlights_Left.PB15/HI_BEAM/RE_BRAKE
NetC18_1: C18.1 U6.6(SR)
NetC19_1: C19.1 U7.6(SR)
NetC22_1: C22.1 U8.6(SR)
NetC23_1: C23.1 U9.6(SR)
NetLED10_1: LED10.1(A) R17.2
NetLED11_1: LED11.1(A) R18.2
NetLED12_1: LED12.1(A) R21.2
NetLED13_1: LED13.1(A) R22.2
NetR15_2: R15.2 U6.5(BLEED)
NetR16_2: R16.2 U7.5(BLEED)
NetR19_2: R19.2 U8.5(BLEED)
NetR20_2: R20.2 U9.5(BLEED)

### Layout directives
rule Power Plane Connect Style [Style - Direct Connect]: LF_HIGH_BEAM/LR_BRAKE_4, LF_LOW_BEAM/LR_OUTER_BRAKE_4
net class High Current: LF_LOW_BEAM/LR_OUTER_BRAKE_4

### Notes on the sheet
- Left Headlight Assem/Rear left Brake & Turn
- Note: High Beam will use Low Beam
- DRL will use parking light
- Low Beam will use DRL
- Do not populate capacitor on SR
- Project:
- Title:
- Size:
- Project Lead:
- Letter
- Revision:
- University of Waterloo
- 200 University Ave W
- Waterloo, ON, Canada
- N2L 3E9
- Date:
- Sheet
- of
- Website:
- (in symbol CAP ALUM 56UF 20% 35V RADIAL) +

### Library data of the parts
C14 = CAP ALUM 56UF 20% 35V RADIAL: 56µF 35V Aluminum Electrolytic Capacitors Radial, Can 1000 Hrs @ 105°C; Manufacturer: Panasonic Electronic Components; Manufacturer Part Number: EEU-FC1V560H; Polarization: Polar; Supplier 1: Digi-Key; RoHS: RoHS Compliant; Category: Capacitors; Stock 1: 21680; Pricing 1: 1=0.49, 10=0.347, 100=0.2082, 500=0.15622, 1000=0.13193 (CAD); Packaging: Cut Tape (CT); Part Status: Active; ESR (Equivalent Series Resistance): -; Lifetime @ Temp.: 1000 Hrs @ 105°C; Operating Temperature: -55°C ~ 105°C; Ratings: AEC-Q200; Applications: Automotive; Lead Spacing: 0.098" (2.50mm); Size / Dimension: 0.248" Dia (6.30mm); Height - Seated (Max): 0.480" (12.20mm); Surface Mount Land Size: -; Mounting Type: Through Hole; Package / Case: Radial, Can; ComponentLink1URL: http://industrial.panasonic.com/www-cgi/jvcr13pz.cgi?E+PZ+3+ABA0022+EEUFC1V560H+7+WW; ComponentLink1Description: http://industrial.panasonic.com/www-cgi/jvcr13pz.cgi?E+PZ+3+ABA0022+EEUFC1V560H+7+WW; Supplier Part Number 1: P19684CT-ND
C15 = CAP CER 10uF 25V 20% X5R 0603: 10µF ±20% 25V Ceramic Capacitor X5R 0603 (1608 Metric); Manufacturer 1: Murata Electronics North America; Manufacturer Part Number 1: GRM188R61E106MA73D; Supplier 1: Digi-Key; Supplier Part Number 1: 490-7202-1-ND; Packaging: Cut Tape (CT); Part Status: Active; Operating Temperature: -55°C ~ 85°C; Ratings: -; Mounting Type: Surface Mount, MLCC; Package / Case: 0603 (1608 Metric); Size / Dimension: 0.063" L x 0.031" W (1.60mm x 0.80mm); Height - Seated (Max): -; Thickness (Max): 0.031" (0.80mm); Lead Spacing: -; Lead Style: -; ComponentLink1URL: http://www.murata.com/~/media/webrenewal/support/library/catalog/products/capacitor/mlcc/c02e.ashx; ComponentLink1Description: http://www.murata.com/~/media/webrenewal/support/library/catalog/products/capacitor/mlcc/c02e.ashx; Tolerance: ±20%
C16 C17 C20 C21 = CAP CER 0.1UF 50V 10% X7R 0603: as C2 on sheet Lights_Board; Supplier 1: Digi-Key; Supplier Part Number 1: 478-5052-1-ND; Packaging: Cut Tape (CT); Part Status: Active; Operating Temperature: -55°C ~ 125°C; Ratings: -; Mounting Type: Surface Mount, MLCC; Package / Case: 0603 (1608 Metric); Size / Dimension: 0.063" L x 0.032" W (1.60mm x 0.81mm); Height - Seated (Max): -; Thickness (Max): 0.035" (0.90mm); Lead Spacing: -; Lead Style: -; ComponentLink1URL: http://datasheets.avx.com/X7RDielectric.pdf; ComponentLink1Description: http://datasheets.avx.com/X7RDielectric.pdf; Tolerance: ±10%
C18 C19 C22 C23 = CAP CER 2.2UF 25V 10% X5R 0603: as C3 on sheet Lights_Board; Supplier 1: Digi-Key; Supplier Part Number 1: 490-10731-1-ND; Packaging: Cut Tape (CT); Part Status: Active; Operating Temperature: -55°C ~ 85°C; Ratings: -; Mounting Type: Surface Mount, MLCC; Package / Case: 0603 (1608 Metric); Size / Dimension: 0.063" L x 0.031" W (1.60mm x 0.80mm); Height - Seated (Max): -; Thickness (Max): 0.035" (0.90mm); Lead Spacing: -; Lead Style: -; ComponentLink1URL: http://www.murata.com/~/media/webrenewal/support/library/catalog/products/capacitor/mlcc/c02e.ashx; ComponentLink1Description: http://www.murata.com/~/media/webrenewal/support/library/catalog/products/capacitor/mlcc/c02e.ashx; Tolerance: ±10%
LED10-LED13 = LED YELLOW CLEAR 2.1V 0603: as LED1 on sheet Lights_Board; Supplier 1: Digi-Key; RoHS: RoHS Compliant; Category: Optoelectronics; Stock 1: 10523; Pricing 1: 1=0.21, 100=0.1617, 500=0.13964 (CAD); Packaging: Cut Tape (CT); Part Status: Active; Lens Transparency: Clear; Mounting Type: Surface Mount; Wavelength - Dominant: 590nm; Features: -; Package / Case: 0603 (1608 Metric); Supplier Device Package: 0603; Size / Dimension: 1.60mm L x 0.80mm W; Height (Max): 0.80mm; ComponentLink1URL: http://katalog.we-online.de/led/datasheet/150060YS75000.pdf; ComponentLink1Description: http://katalog.we-online.de/led/datasheet/150060YS75000.pdf; Supplier Part Number 1: 732-4981-1-ND
P7 = CONN 6POS ULTRA-FIT NATURAL COLOR 0.138": 6 Positions Header Connector 0.138" (3.50mm) Through Hole Tin; Manufacturer 1: Molex, LLC; Manufacturer Part Number 1: 1722992106; Description 1: ULTRAFIT VERT TIN PLATED NAT; Style: Board to Cable/Wire; Shrouding: Shrouded - 4 Wall; Number of Positions: 6; Number of Positions Loaded: All; Row Spacing - Mating: 0.181" (4.60mm); Contact Length - Post: 0.126" (3.20mm); Material Flammability Rating: UL94 V-0; Voltage Rating: 400V; Mated Stacking Heights: 26.99mm; Supplier 1: Digi-Key; Supplier Part Number 1: WM11799-ND; RoHS: RoHS Compliant; Category: Connectors, Interconnects; Stock 1: 315; Pricing 1: 1=1.85, 10=1.617, 50=1.4586, 100=1.395, 250=1.26816, 500=1.14134, 1000=1.01453, 2500=0.91942, 5000=0.88771 (CAD); Packaging: Tray; Part Status: Active; Connector Type: Header; Contact Type: Male Pin; Pitch - Mating: 0.138" (3.50mm); Number of Rows: 2; Mounting Type: Through Hole; Termination: Solder; Fastening Type: Latch Holder; Contact Length - Mating: -; Overall Contact Length: -; Insulation Height: 0.465" (11.80mm); Contact Shape: Square; Contact Finish - Mating: Tin; Contact Finish Thickness - Mating: 60µin (1.52µm); Contact Finish - Post: Tin; Contact Material: Copper Alloy; Insulation Material: Liquid Crystal Polymer (LCP); Features: Board Guide, Solder Retention; Operating Temperature: -40°C ~ 105°C; Ingress Protection: -; Current Rating: -; Contact Finish Thickness - Post: 60µin (1.52µm); Applications: Automotive, General Purpose, Industrial, Lighting, Medical, Military, Telecommunications; ComponentLink1URL: http://www.molex.com/pdm_docs/sd/1722992106_sd.pdf; ComponentLink1Description: http://www.molex.com/pdm_docs/sd/1722992106_sd.pdf
R15 R16 R19 R20 = RES SMD 200 OHM 1% 1/2W 0805: 200 Ohms ±1% 0.5W, 1/2W Chip Resistor 0805 (2012 Metric) Automotive AEC-Q200, Pulse Withstanding Thick Film; Manufacturer: Panasonic Electronic Components; Manufacturer Part Number: ERJ-P06F2000V; Temperature Coefficient: ±100ppm/°C; Supplier 1: Digi-Key; RoHS: RoHS Compliant; Category: Resistors; Stock 1: 46246; Pricing 1: 1=0.27, 10=0.226, 100=0.0884, 1000=0.03699, 2500=0.0339 (CAD); Packaging: Cut Tape (CT); Part Status: Active; Composition: Thick Film; Features: Automotive AEC-Q200, Pulse Withstanding; Operating Temperature: -55°C ~ 155°C; Package / Case: 0805 (2012 Metric); Supplier Device Package: 0805; Size / Dimension: 0.079" L x 0.049" W (2.00mm x 1.25mm); Height - Seated (Max): 0.028" (0.70mm); Failure Rate: -; ComponentLink1URL: https://industrial.panasonic.com/cdbs/www-data/pdf/RDO0000/AOA0000C331.pdf; ComponentLink1Description: https://industrial.panasonic.com/cdbs/www-data/pdf/RDO0000/AOA0000C331.pdf
R17 R18 R21 R22 = RES 10K OHM 1% 1/10W 0603: as R1 on sheet Lights_Board; Supplier 1: Digi-Key; Supplier Part Number 1: 311-10.0KHRCT-ND; Packaging: Cut Tape (CT); Part Status: Active; Composition: Thick Film; Operating Temperature: -55°C ~ 155°C; Package / Case: 0603 (1608 Metric); Supplier Device Package: 0603; Size / Dimension: 0.063" L x 0.031" W (1.60mm x 0.80mm); Height - Seated (Max): 0.022" (0.55mm); Failure Rate: -; ComponentLink1URL: http://www.yageo.com/documents/recent/PYu-RC_Group_51_RoHS_L_7.pdf; ComponentLink1Description: http://www.yageo.com/documents/recent/PYu-RC_Group_51_RoHS_L_7.pdf; Tolerance: ±1%
U6-U9 = IC LOAD SWITCH ACT-HI 10.5A 8DFN: as U1 on sheet Lights_Board; Manufacturer Part Number: NCP45521IMNTWG-H; RoHS: RoHS Compliant; Category: Integrated Circuits (ICs); Packaging: Digi-Reel®; Part Status: Active; Current - Output (Max): 10.5A; Features: Slew Rate Controlled; Operating Temperature: -40°C ~ 85°C (TA); Package / Case: 8-VFDFN Exposed Pad; Supplier Device Package: 8-DFN (2x2); ComponentLink1URL: http://www.onsemi.com/pub/Collateral/NCP45520-D.PDF; ComponentLink1Description: http://www.onsemi.com/pub/Collateral/NCP45520-D.PDF; Supplier 1: Digi-Key; Stock 1: 2377; Pricing 1: 1=1.57, 10=1.405, 100=1.0957, 500=0.90518, 1000=0.71462 (CAD); Supplier 2: Digi-Key; Stock 2: 2211; Pricing 2: 1=1.53, 10=1.372, 100=1.0702, 500=0.88408, 1000=0.69797 (CAD)